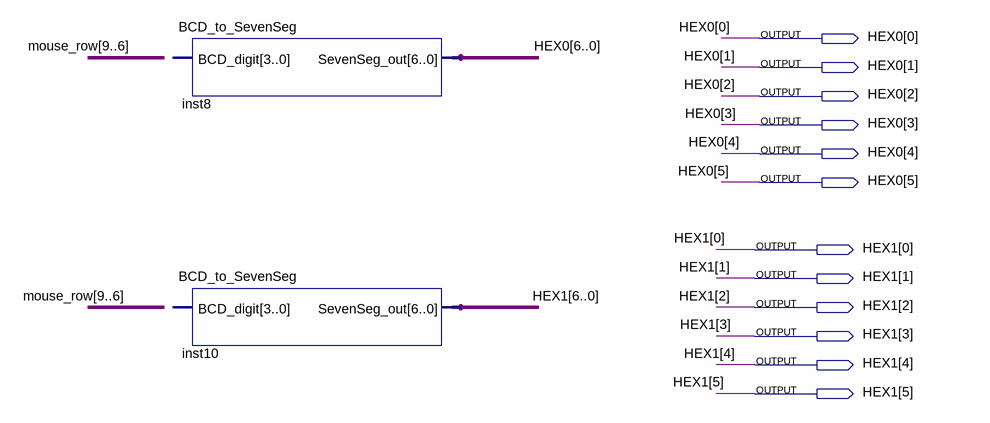
[diagram p0: schematic sheet]
// Quartus schematic extracomponents.bdf as structural Verilog: 2 symbols, 12 pins
module extracomponents (
  output [6:0] HEX0,
  output [6:0] HEX1
);

  BCD_to_SevenSeg inst8 (.SevenSeg_out(HEX0));  // open: BCD_digit
  BCD_to_SevenSeg inst10 (.SevenSeg_out(HEX1));  // open: BCD_digit
endmodule
